# Altium project OPENMV4_Genaral.PrjPcb
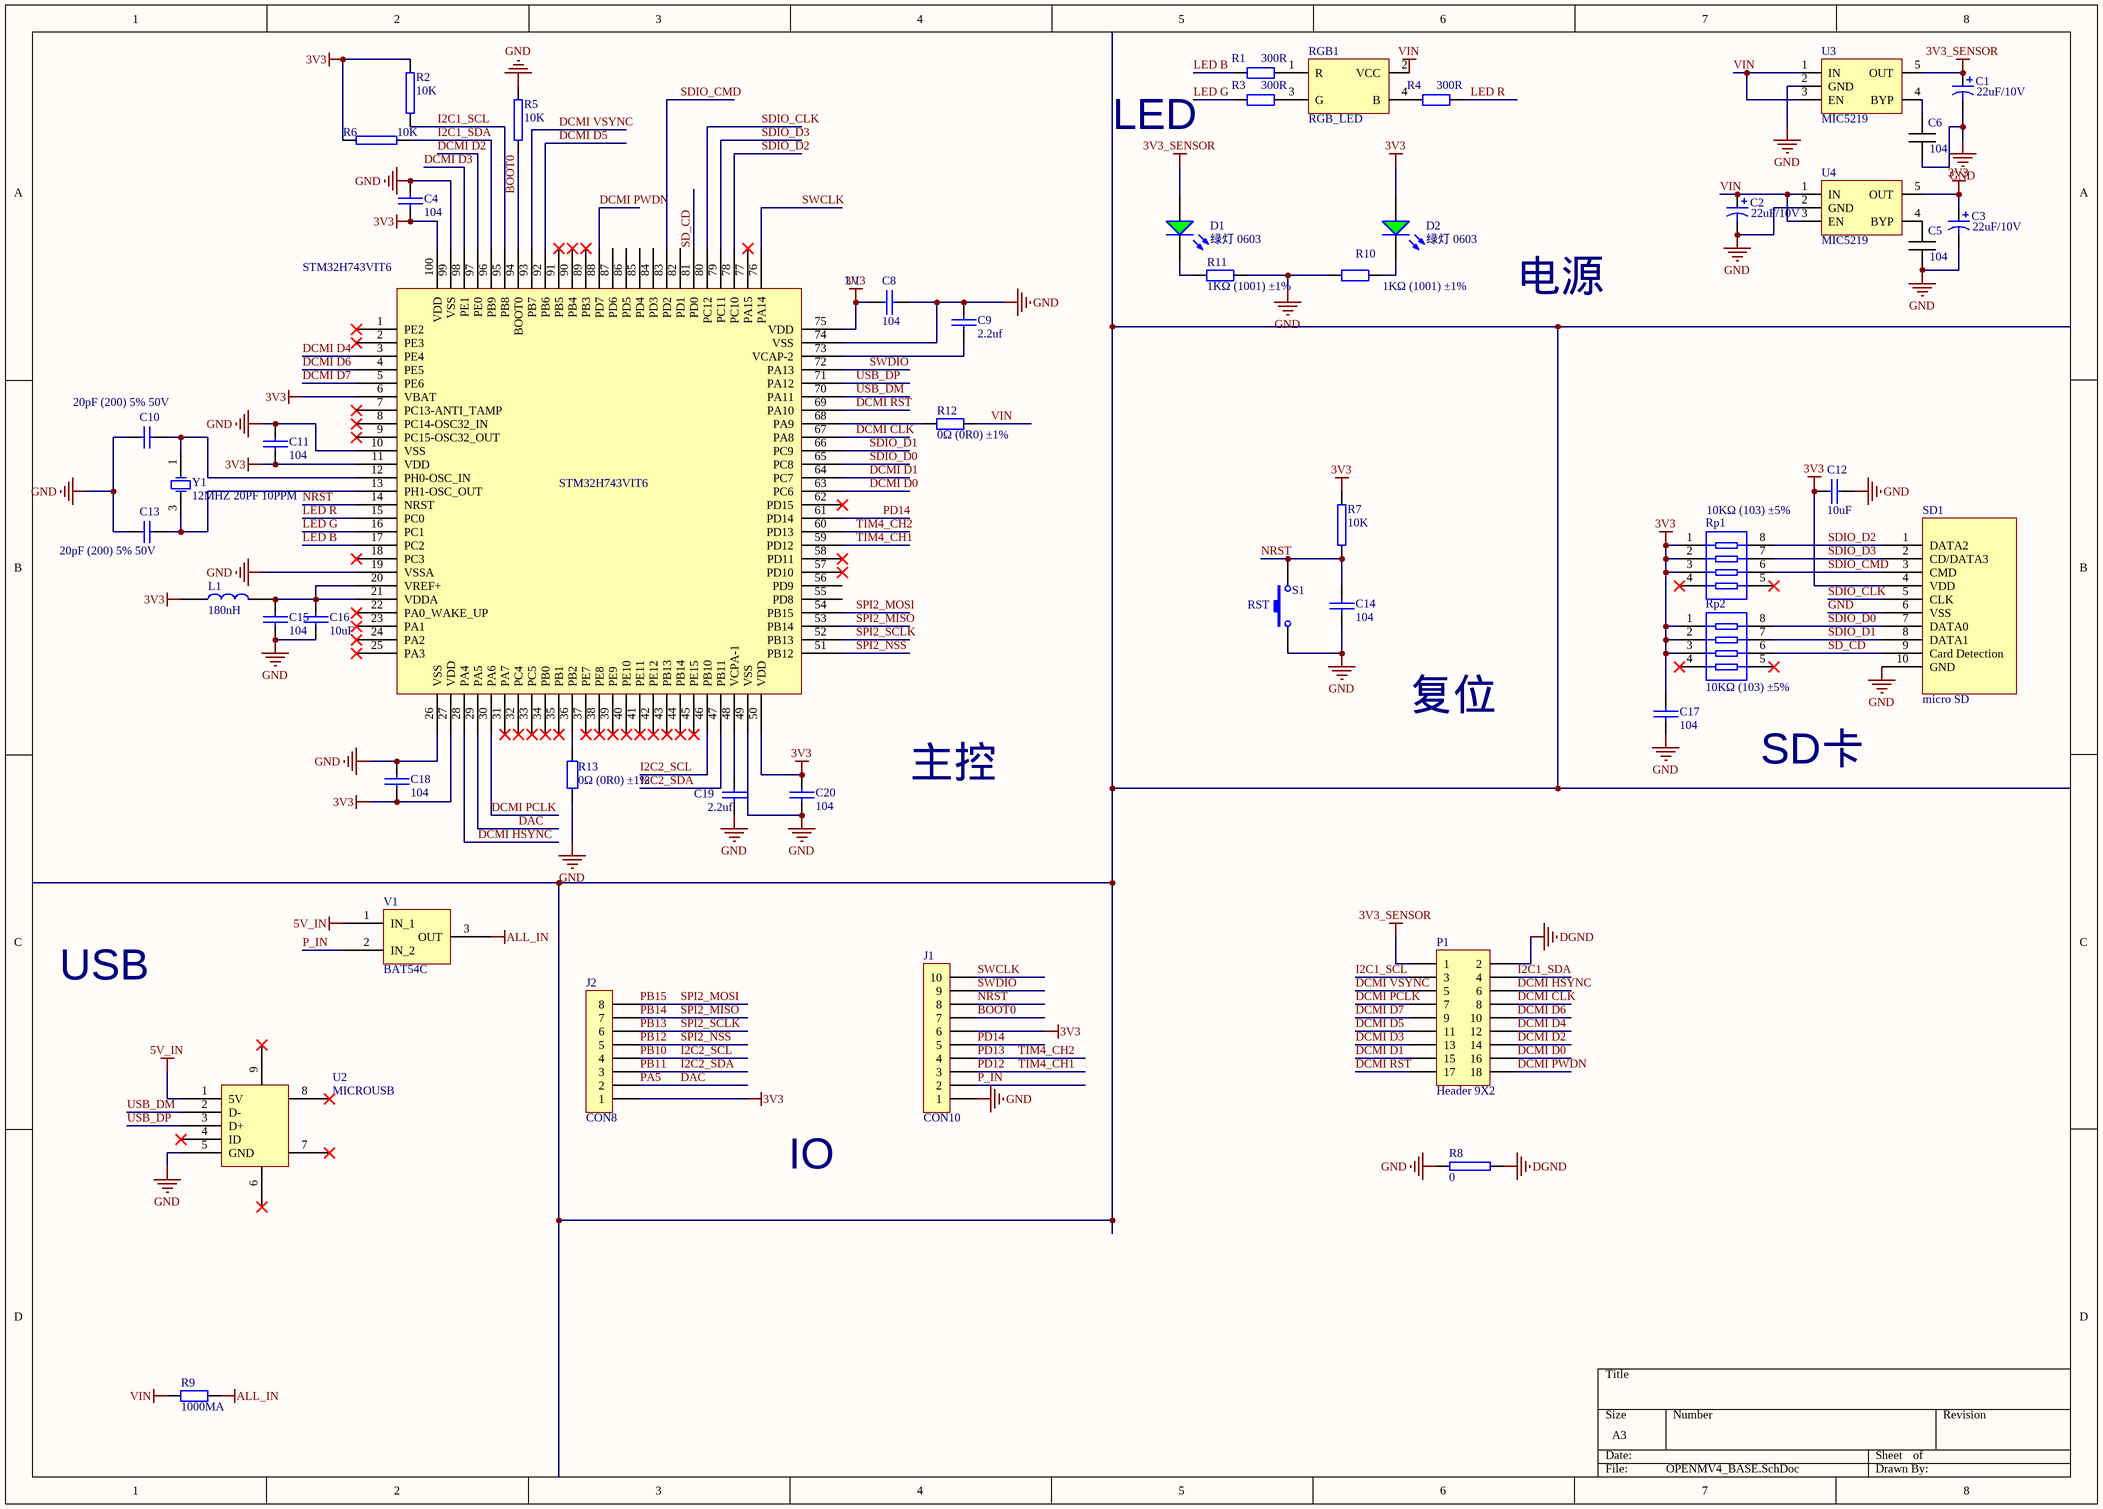
[diagram p0: OPENMV4_BASE.SchDoc]
1 sheet, 49 parts. Net scope: global (net labels, ports and power ports of the same name join across sheets).
Board file: OPENMV4_BASE.PcbDoc

## Sheet OPENMV4_BASE.SchDoc
size A3

### Parts
C1  value 22uF/10V  [1206_C]  (hidden comment: 47uF)
C2  value 22uF/10V  [1206_C]  (hidden comment: 47uF)
C3  value 22uF/10V  [1206_C]  (hidden comment: 47uF)
C4  104  [0603_C]
C5  104  [0603_C]
C6  104  [0603_C]
C8  104  [0603_C]
C9  2.2uf  [0603_C]
C10  20pF (200) 5% 50V  [0603_C]
C11  104  [0603_C]
C12  10uF  [0603_C]
C13  20pF (200) 5% 50V  [0603_C]
C14  104  [0603_C]
C15  104  [0603_C]
C16  10uF  [0603_C]
C17  104  [0603_C]
C18  104  [0603_C]
C19  2.2uf  [0603_C]
C20  104  [0603_C]
D1  绿灯 0603  [0603_LED_S1]
D2  绿灯 0603  [0603_LED_S1]
J1  CON10  [HDR1X10]
J2  CON8  [HDR1X8]
L1  180nH  [0603_L]
P1  Header 9X2  [HDR2X9]
R1  value 300R  [0603_R]  (hidden comment: 1K)
R2  10K  [0603_R]
R3  value 300R  [0603_R]  (hidden comment: 1K)
R4  value 300R  [0603_R]  (hidden comment: 1K)
R5  10K  [0603_R]
R6  10K  [0603_R]
R7  10K  [0603_R]
R8  0  [0603_R]
R9  value 1000MA  [0603_R]  (hidden comment: 1A保险丝)
R10  1KΩ (1001) ±1%  [0603_R]
R11  1KΩ (1001) ±1%  [0603_R]
R12  0Ω (0R0) ±1%  [0603_R]
R13  0Ω (0R0) ±1%  [0603_R]
RGB1  RGB_LED  [RGB3528]
Rp1  10KΩ (103) ±5%  [0603_Rx4]
Rp2  10KΩ (103) ±5%  [0603_Rx4]
S1  RST  [KEY]
SD1  micro SD  [SD]
U1  STM32H743VIT6  [LQFP-100_14x14x05P]
U2  MICROUSB  [micro usb]
U3  MIC5219  [SOT-23-5]
U4  MIC5219  [SOT-23-5]
V1  BAT54C  [SOT-23(SOT-23-3)]
Y1  12MHZ 20PF 10PPM  [SMD-3225_4P]

### Nets
3V3: C3.1 C4.2 C8.2 C11.2 C12.2 C17.2 C18.2 C20.2 D2.A J1.6 J2.1 L1.1 R2.2 R6.1 R7.1 Rp1.1 Rp1.2 Rp1.3 Rp2.1 Rp2.2 Rp2.3 SD1.4(VDD) U1.6(VBAT) U1.11(VDD) U1.27(VDD) U1.50(VDD) U1.75(VDD) U1.100(VDD) U4.5(OUT)
3V3_SENSOR: C1.1 D1.A P1.1 U3.5(OUT)
5V_IN: U2.1(5V) V1.1(IN_1)
ALL_IN: R9.2 V1.3(OUT)
DGND: P1.2 R8.2
GND: C1.2 C2.2 C3.2 C4.1 C5.1 C6.1 C8.1 C9.2 C10.2 C11.1 C12.1 C13.2 C14.1 C15.2 C16.2 C17.1 C18.1 C19.2 C20.1 J1.1 R5.2 R8.1 R10.1 R11.2 R13.2 S1.1 SD1.6(VSS) SD1.10(GND) U1.10(VSS) U1.19(VSSA) U1.26(VSS) U1.49(VSS) U1.74(VSS) U1.99(VSS) U2.5(GND) U3.2(GND) U4.2(GND)
VIN: C2.1 R9.1 R12.2 RGB1.2(VCC) U3.1(IN) U3.3(EN) U4.1(IN) U4.3(EN)
BOOT0: J1.7 R5.1 U1.94(BOOT0)
DAC: J2.2 U1.29(PA5)  [also labelled PA5]
DCMI CLK: P1.8 U1.67(PA8)
DCMI D0: P1.16 U1.63(PC6)
DCMI D1: P1.15 U1.64(PC7)
DCMI D2: P1.14 U1.97(PE0)
DCMI D3: P1.13 U1.98(PE1)
DCMI D4: P1.12 U1.3(PE4)
DCMI D5: P1.11 U1.92(PB6)
DCMI D6: P1.10 U1.4(PE5)
DCMI D7: P1.9 U1.5(PE6)
DCMI HSYNC: P1.6 U1.28(PA4)
DCMI PCLK: P1.7 U1.30(PA6)
DCMI PWDN: P1.18 U1.88(PD7)
DCMI RST: P1.17 U1.69(PA10)
DCMI VSYNC: P1.5 U1.93(PB7)
I2C1_SCL: P1.3 R2.1 U1.95(PB8)
I2C1_SDA: P1.4 R6.2 U1.96(PB9)
I2C2_SCL: J2.4 U1.46(PB10)  [also labelled PB10]
I2C2_SDA: J2.3 U1.47(PB11)  [also labelled PB11]
LED B: R1.1 U1.17(PC2)
LED G: R3.1 U1.16(PC1)
LED R: R4.2 U1.15(PC0)
NRST: C14.2 J1.8 R7.2 S1.2 U1.14(NRST)
P_IN: J1.2 V1.2(IN_2)
PB12: J2.5 U1.51(PB12)  [also labelled SPI2_NSS]
PB13: J2.6 U1.52(PB13)  [also labelled SPI2_SCLK]
PB14: J2.7 U1.53(PB14)  [also labelled SPI2_MISO]
PB15: J2.8 U1.54(PB15)  [also labelled SPI2_MOSI]
PD12: J1.3 U1.59(PD12)  [also labelled TIM4_CH1]
PD13: J1.4 U1.60(PD13)  [also labelled TIM4_CH2]
PD14: J1.5 U1.61(PD14)
SD_CD: Rp2.6 SD1.9(Card_Detection) U1.81(PD0)
SDIO_CLK: SD1.5(CLK) U1.80(PC12)
SDIO_CMD: Rp1.6 SD1.3(CMD) U1.83(PD2)
SDIO_D0: Rp2.8 SD1.7(DATA0) U1.65(PC8)
SDIO_D1: Rp2.7 SD1.8(DATA1) U1.66(PC9)
SDIO_D2: Rp1.8 SD1.1(DATA2) U1.78(PC10)
SDIO_D3: Rp1.7 SD1.2(CD/DATA3) U1.79(PC11)
SWCLK: J1.10 U1.76(PA14)
SWDIO: J1.9 U1.72(PA13)
USB_DM: U1.70(PA11) U2.2(D-)
USB_DP: U1.71(PA12) U2.3(D+)
NetC5_2: C5.2 U4.4(BYP)
NetC6_2: C6.2 U3.4(BYP)
NetC9_1: C9.1 U1.73(VCAP-2)
NetC10_1: C10.1 U1.12(PH0-OSC_IN) Y1.1(OSC1)
NetC13_1: C13.1 U1.13(PH1-OSC_OUT) Y1.3(OSC2)
NetC15_1: C15.1 C16.1 L1.2 U1.20(VREF+) U1.21(VDDA)
NetC19_1: C19.1 U1.48(VCPA-1)
NetD1_K: D1.K R11.1
NetD2_K: D2.K R10.2
NetR1_2: R1.2 RGB1.1(R)
NetR3_2: R3.2 RGB1.3(G)
NetR4_1: R4.1 RGB1.4(B)
NetR12_1: R12.1 U1.68(PA9)
NetR13_1: R13.1 U1.36(PB2)

Not connected (* = marked no-connect by the designer): Rp1 4* 5*; Rp2 4* 5*; U1 1(PE2)* 2(PE3)* 7(PC13-ANTI_TAMP)* 8(PC14-OSC32_IN)* 9(PC15-OSC32_OUT)* 18(PC3)* 22(PA0_WAKE_UP)* 23(PA1)* 24(PA2)* 25(PA3)* 31(PA7)* 32(PC4)* 33(PC5)* 34(PB0)* 35(PB1)* 37(PE7)* 38(PE8)* 39(PE9)* 40(PE10)* 41(PE11)* 42(PE12)* 43(PB13)* 44(PB14)* 45(PE15)* 55(PD8) 56(PD9) 57(PD10)* 58(PD11)* 62(PD15)* 77(PA15)* 82(PD1) 84(PD3) 85(PD4) 86(PD5) 87(PD6) 89(PB3)* 90(PB4)* 91(PB5)*; U2 4(ID)* 6* 7* 8* 9*

### Notes on the sheet
- LED
- 电源
- 复位
- 主控
- SD卡
- USB
- IO

### Library data of the parts
C1-C3 = Cap Pol1: Polarized Capacitor (Radial); Published: 8-Jun-2000; LatestRevisionDate: 17-Jul-2002; LatestRevisionNote: Re-released for DXP Platform.; PackageReference: RB7.6-15; Publisher: Altium Limited
C4 C8 C9 C11 C12 C14-C20 = CAP
C5 C6 = CAP104
C10 C13 = 0603 20pF (200) 5% 50V: 贴片电容; ComponentLink1Description: 供应商链接; ComponentLink1URL: http://www.szlcsc.com/product/details_2000.html; Package: 0603; Supplier: LC; SuppliersPartNumber: C1648
D1 D2 = 0603 绿灯: 发光二极管; ComponentLink1Description: 供应商链接; ComponentLink1URL: http://www.szlcsc.com/product/details_73152.html; Package: 0603; Supplier: LC; SuppliersPartNumber: C72043
L1 = Inductor
P1 = Header 9X2: Header, 9-Pin, Dual row; LatestRevisionDate: 17-Jul-2002; LatestRevisionNote: Re-released for DXP Platform.; Publisher: Altium Limited
R1 R3 R4 R9 = Res2: Resistor; Published: 8-Jun-2000; LatestRevisionDate: 17-Jul-2002; LatestRevisionNote: Re-released for DXP Platform.; PackageReference: AXIAL-0.4; Publisher: Altium Limited
R2 R5-R8 = RES
R10 R11 = 0603 1KΩ (1001) 1%: 贴片电阻; ComponentLink1Description: 供应商链接; ComponentLink1URL: http://www.szlcsc.com/product/details_21904.html; Package: 0603; Supplier: LC; SuppliersPartNumber: C21190
R12 R13 = 0603 0Ω (0R0) 1%: 贴片电阻; ComponentLink1Description: 供应商链接; ComponentLink1URL: http://www.szlcsc.com/product/details_21903.html; Package: 0603; Supplier: LC; SuppliersPartNumber: C21189
RGB1 = RGB_LED: 三色高亮LED
Rp1 Rp2 = 0603*4  10KΩ (103) 5%: 贴片排阻; ComponentLink1Description: 供应商链接; ComponentLink1URL: http://www.szlcsc.com/product/details_30472.html; Package: 0603*4; Supplier: LC; SuppliersPartNumber: C29718
S1 = SW-PB: Switch; Published: 24-Mar-1999; LatestRevisionDate: 17-Jul-2002; LatestRevisionNote: Re-released for DXP Platform.; PackageReference: SPST-2; Publisher: Altium Limited; PackageDescription: Switch; 2 Leads
U3 U4 = MIC5219: 3.3V 降压芯片
Y1 = SMD-3225_4P  12MHZ 20PF 10PPM: 贴片晶振; ComponentLink1Description: 供应商链接; ComponentLink1URL: http://www.szlcsc.com/product/details_9522.html; Package: SMD-3225_4P; Supplier: LC; SuppliersPartNumber: C9002